# EAGLE schematic GPIO (EAGLE 7.1.0)
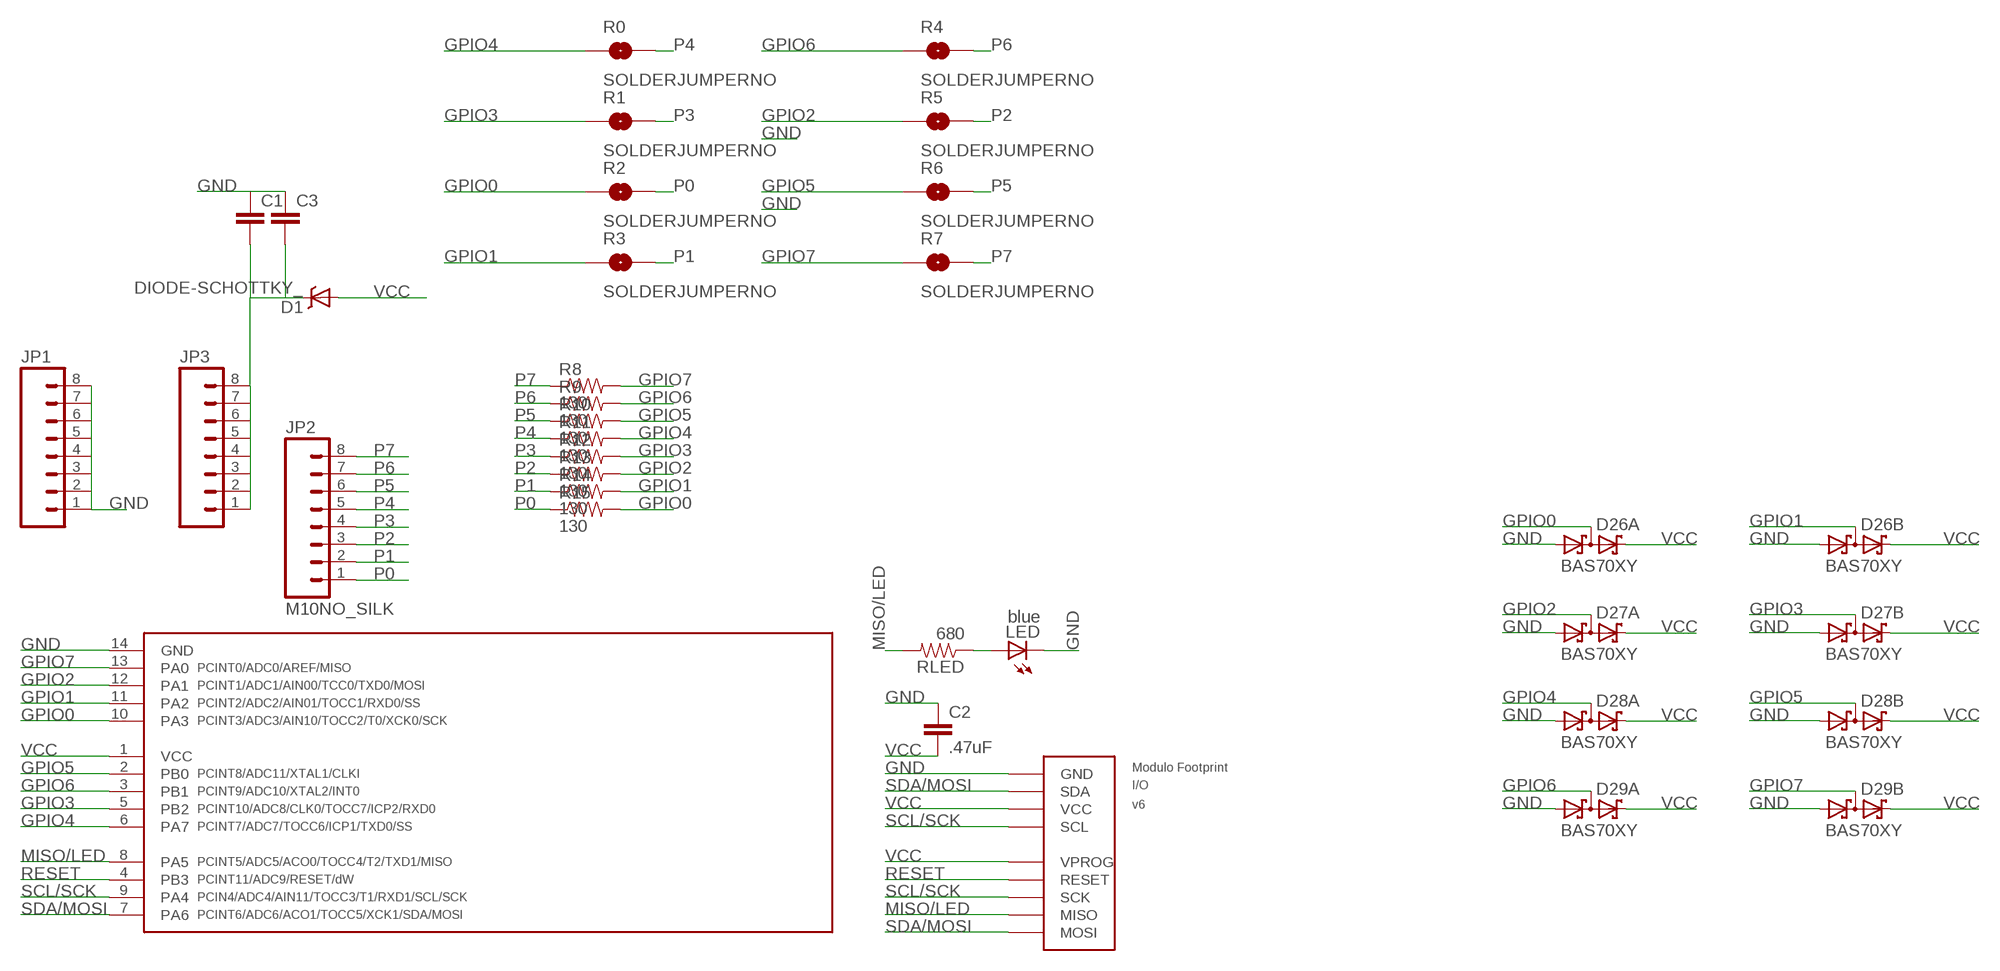
[diagram p0: schematic, sheet 1]

## Parts
C1  CAP1206  [1206]
C2  .47uF  CAP0805  [0805]
C3  CAP1206  [1206]
D1  DIODE-SCHOTTKY_  [SMA-DIODE]
D26  BAS70XY  [SOT363_PHILIPS]
D27  BAS70XY  [SOT363_PHILIPS]
D28  BAS70XY  [SOT363_PHILIPS]
D29  BAS70XY  [SOT363_PHILIPS]
JP1  M08NO_SILK  [1X08_NO_SILK]
JP2  M10NO_SILK  M08NO_SILK  [1X08_NO_SILK]
JP3  M08NO_SILK  [1X08_NO_SILK]
LED  blue  LEDCHIPLED_0805  [CHIPLED_0805]
R0  SOLDERJUMPERNO  [SJ_2S-NO]
R1  SOLDERJUMPERNO  [SJ_2S-NO]
R2  SOLDERJUMPERNO  [SJ_2S-NO]
R3  SOLDERJUMPERNO  [SJ_2S-NO]
R4  SOLDERJUMPERNO  [SJ_2S-NO]
R5  SOLDERJUMPERNO  [SJ_2S-NO]
R6  SOLDERJUMPERNO  [SJ_2S-NO]
R7  SOLDERJUMPERNO  [SJ_2S-NO]
R8  130  RESISTOR0805-RES  [0805]
R9  130  RESISTOR0805-RES  [0805]
R10  130  RESISTOR0805-RES  [0805]
R11  130  RESISTOR0805-RES  [0805]
R12  130  RESISTOR0805-RES  [0805]
R13  130  RESISTOR0805-RES  [0805]
R14  130  RESISTOR0805-RES  [0805]
R15  130  RESISTOR0805-RES  [0805]
RLED  680  RESISTOR0805-RES  [0805]
U$3  TINY841  [SOIC14]
U$4  FOOTPRINTFOOTPRINT-2  [FOOTPRINT2]

## Nets
GND: C1.1 C2.1 C3.1 D26.1(A:A1) D26.4(B:A1) D27.1(A:A1) D27.4(B:A1) D28.1(A:A1) D28.4(B:A1) D29.1(A:A1) D29.4(B:A1) JP1.1 JP1.2 JP1.3 JP1.4 JP1.5 JP1.6 JP1.7 JP1.8 LED.C U$3.14(GND) U$4.BUS0(GND)
GPIO0: D26.6(A:C1A2) R2.1 R15.2 U$3.10(PA3)
GPIO1: D26.3(B:C1A2) R3.1 R14.2 U$3.11(PA2)
GPIO2: D27.6(A:C1A2) R5.1 R13.2 U$3.12(PA1)
GPIO3: D27.3(B:C1A2) R1.1 R12.2 U$3.5(PB2)
GPIO4: D28.6(A:C1A2) R0.1 R11.2 U$3.6(PA7)
GPIO5: D28.3(B:C1A2) R6.1 R10.2 U$3.2(PB0)
GPIO6: D29.6(A:C1A2) R4.1 R9.2 U$3.3(PB1)
GPIO7: D29.3(B:C1A2) R7.1 R8.2 U$3.13(PA0)
MISO/LED: RLED.2 U$3.8(PA5) U$4.PROG3(MISO)
N$5: LED.A RLED.1
P0: JP2.1 R2.2 R15.1
P1: JP2.2 R3.2 R14.1
P2: JP2.3 R5.2 R13.1
P3: JP2.4 R1.2 R12.1
P4: JP2.5 R0.2 R11.1
P5: JP2.6 R6.2 R10.1
P6: JP2.7 R4.2 R9.1
P7: JP2.8 R7.2 R8.1
RESET: U$3.4(PB3) U$4.PROG1(RESET)
SCL/SCK: U$3.9(PA4) U$4.BUS3(SCL) U$4.PROG2(SCK)
SDA/MOSI: U$3.7(PA6) U$4.BUS1(SDA) U$4.PROG4(MOSI)
VCC: C2.2 D1.A D26.2(A:C2) D26.5(B:C2) D27.2(A:C2) D27.5(B:C2) D28.2(A:C2) D28.5(B:C2) D29.2(A:C2) D29.5(B:C2) U$3.1(VCC) U$4.BUS2(VCC) U$4.PROG0(VPROG)
VOUT: C1.2 C3.2 D1.C JP3.1 JP3.2 JP3.3 JP3.4 JP3.5 JP3.6 JP3.7 JP3.8

## Library data of the parts
C1-C3 = SparkFun-Capacitors:CAP: Capacitor Standard 0603 ceramic capacitor, and 0.1" leaded capacitor.
D1 = SparkFun-DiscreteSemi:DIODE-SCHOTTKY: Commonly MBRA140.
D26-D29 = diode:BAS70XY: Silicon Schottky Diodes General-purpose diode for high-speed switching Source: BAS70_1PS7XSB70_SER_8.pdf
JP1-JP3 = SparkFun-Connectors:M08: Header 8 Standard 8-pin 0.1" header. Use with straight break away headers (SKU : PRT-00116), right angle break away headers (PRT-00553), swiss pins (PRT-00743), machine pins (PRT-00117), and female headers (PRT-00115).
LED = adafruit:LED: LED OSRAM: - CHIPLED LG R971, LG N971, LY N971, LG Q971, LY Q971, LO R971, LY R971 LH N974, LH R974 LS Q976, LO Q976, LY Q976 LO Q996 - Hyper CHIPLED LW Q18S LB Q993, LB Q99A, LB R99A - SideLED LS A670, LO A670, LY A670, LG A670, LP A670 LB A673, LV A673, LT A673, LW A673 LH A674 LY A675 LS A676, LA A676, LO A676, LY A676, LW A676 LS A679, LY A679, LG A679 - Hyper Micro SIDELED® LS Y876, LA Y876, LO Y876, LY Y876 LT Y87S - SmartLED LW L88C, LW L88S LB L89C, LB L89S, LG L890 LS L89K, LO L89K, LY L89K LS L896, LA L896, LO L896, LY L896 - TOPLED LS T670, LO T670, LY T670, LG T670, LP T670 LSG T670, LSP T670, LSY T670, LOP T670, LYG T670 LG T671, LOG T671, LSG T671 LB T673, LV T673, LT T673, LW T673 LH T674 LS T676, LA T676, LO T676, LY T676, LB T676, LH T676, LSB T676, LW T676 LB T67C, LV T67C, LT T67C, LS T67K, LO T67K, LY T67K, LW E67C LS E67B, LA E67B, LO E67B, LY E67B, LB E67C, LV E67C, LT E67C LW T67C LS T679, LY T679, LG T679 LS T770, LO T770, LY T770, LG T770, LP T770 LB T773, LV T773, LT T773, LW T773 LH T774 LS E675, LA E675, LY E675, LS T675 LS T776, LA T776, LO T776, LY T776, LB T776 LHGB T686 LT T68C, LB T68C - Hyper Mini TOPLED® LB M676 - Mini TOPLED Santana® LG M470 LS M47K, LO M47K, LY M47K Source: http://www.osram.convergy.de/
R0 R1-R7 = SparkFun-Passives:SOLDERJUMPER: Solder Jumper Standard SMD solder jumper. Used to automate production. Two varients : Normally Open and Normally Closed are the same, but have different paste layers. NC will have a large amount of paste and should jumper during reflow.
R8-R15 = SparkFun-Resistors:RESISTOR: Resistor Basic schematic elements and footprints for 0603, 1206, and PTH resistors.
RLED = SparkFun-Passives:RESISTOR: Resistor Basic schematic elements and footprints for 0603, 1206, and PTH resistors.
U$3 = IntegerLabs:TINY841
U$4 = IntegerLabs:FOOTPRINT: Modulo Footprint; BOARD: I/O; VERSION: v6